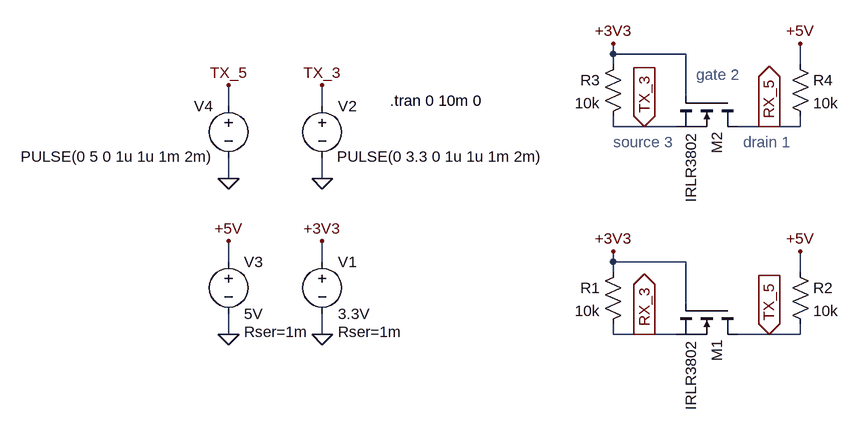
[diagram p0: schematic level shift.asc]
level shift.asc, the LTspice schematic file:
Version 4
SHEET 1 1936 680
WIRE 384 -336 384 -352
WIRE 496 -336 384 -336
WIRE 384 -320 384 -336
WIRE 672 -320 672 -352
WIRE 496 -272 496 -336
WIRE -208 -256 -208 -288
WIRE -64 -256 -64 -288
WIRE 384 -224 384 -240
WIRE 432 -224 384 -224
WIRE 480 -224 432 -224
WIRE 624 -224 576 -224
WIRE 672 -224 672 -240
WIRE 672 -224 624 -224
WIRE -208 -144 -208 -176
WIRE -64 -144 -64 -176
WIRE -208 -16 -208 -48
WIRE -64 -16 -64 -48
WIRE 384 -16 384 -32
WIRE 496 -16 384 -16
WIRE 384 0 384 -16
WIRE 672 0 672 -32
WIRE 496 48 496 -16
WIRE -208 96 -208 64
WIRE -64 96 -64 64
WIRE 384 96 384 80
WIRE 432 96 384 96
WIRE 480 96 432 96
WIRE 624 96 576 96
WIRE 672 96 672 80
WIRE 672 96 624 96
FLAG -64 96 0
FLAG -64 -48 +3V3
FLAG -64 -144 0
FLAG -64 -288 TX_3
FLAG -208 96 0
FLAG -208 -48 +5V
FLAG 384 -32 +3V3
FLAG 672 -32 +5V
FLAG -208 -144 0
FLAG -208 -288 TX_5
FLAG 384 -352 +3V3
FLAG 432 -224 TX_3
IOPIN 432 -224 In
FLAG 672 -352 +5V
FLAG 624 96 TX_5
IOPIN 624 96 In
FLAG 432 96 RX_3
IOPIN 432 96 Out
FLAG 624 -224 RX_5
IOPIN 624 -224 Out
SYMBOL voltage -64 -32 R0
WINDOW 123 0 0 Left 2
WINDOW 39 24 124 Left 2
SYMATTR SpiceLine Rser=1m
SYMATTR InstName V1
SYMATTR Value 3.3V
SYMBOL voltage -64 -272 R0
WINDOW 123 0 0 Left 2
WINDOW 39 0 0 Left 2
WINDOW 3 23 94 Left 2
SYMATTR Value PULSE(0 3.3 0 1u 1u 1m 2m)
SYMATTR InstName V2
SYMBOL voltage -208 -32 R0
WINDOW 123 0 0 Left 2
WINDOW 39 24 124 Left 2
SYMATTR SpiceLine Rser=1m
SYMATTR InstName V3
SYMATTR Value 5V
SYMBOL res 400 -16 M0
SYMATTR InstName R1
SYMATTR Value 10k
SYMATTR SpiceLine tol=5 pwr=0.25
SYMBOL nmos 576 48 R90
SYMATTR InstName M1
SYMATTR Value IRLR3802
SYMBOL res 656 -16 R0
SYMATTR InstName R2
SYMATTR Value 10k
SYMATTR SpiceLine tol=5 pwr=0.25
SYMBOL voltage -208 -272 M0
WINDOW 123 0 0 Left 2
WINDOW 39 0 0 Left 2
WINDOW 3 23 94 Left 2
SYMATTR Value PULSE(0 5 0 1u 1u 1m 2m)
SYMATTR InstName V4
SYMBOL res 400 -336 M0
SYMATTR InstName R3
SYMATTR Value 10k
SYMATTR SpiceLine tol=5 pwr=0.25
SYMBOL nmos 576 -272 R90
SYMATTR InstName M2
SYMATTR Value IRLR3802
SYMBOL res 656 -336 R0
SYMATTR InstName R4
SYMATTR Value 10k
SYMATTR SpiceLine tol=5 pwr=0.25
TEXT 40 -264 Left 2 !.tran 0 10m 0
TEXT 384 -200 Left 2 ;source 3
TEXT 584 -200 Left 2 ;drain 1
TEXT 512 -304 Left 2 ;gate 2

The netlist it stands for:
* level shift.asc
V1 +3V3 0 3.3V Rser=1m
V2 TX_3 0 PULSE(0 3.3 0 1u 1u 1m 2m)
V3 +5V 0 5V Rser=1m
R1 +3V3 RX_3 10k tol=5 pwr=0.25
M1 TX_5 +3V3 RX_3 RX_3 IRLR3802
R2 +5V TX_5 10k tol=5 pwr=0.25
V4 TX_5 0 PULSE(0 5 0 1u 1u 1m 2m)
R3 +3V3 TX_3 10k tol=5 pwr=0.25
M2 RX_5 +3V3 TX_3 TX_3 IRLR3802
R4 +5V RX_5 10k tol=5 pwr=0.25
.model NMOS NMOS
.model PMOS PMOS
.lib standard.mos
.tran 0 10m 0
* source 3
* drain 1
* gate 2
.backanno
.end